# Altium schematic sheet ECU_AutoRC_BLK_r00.SchDoc
size A4; SheetNumber: 1; SheetTotal: 8
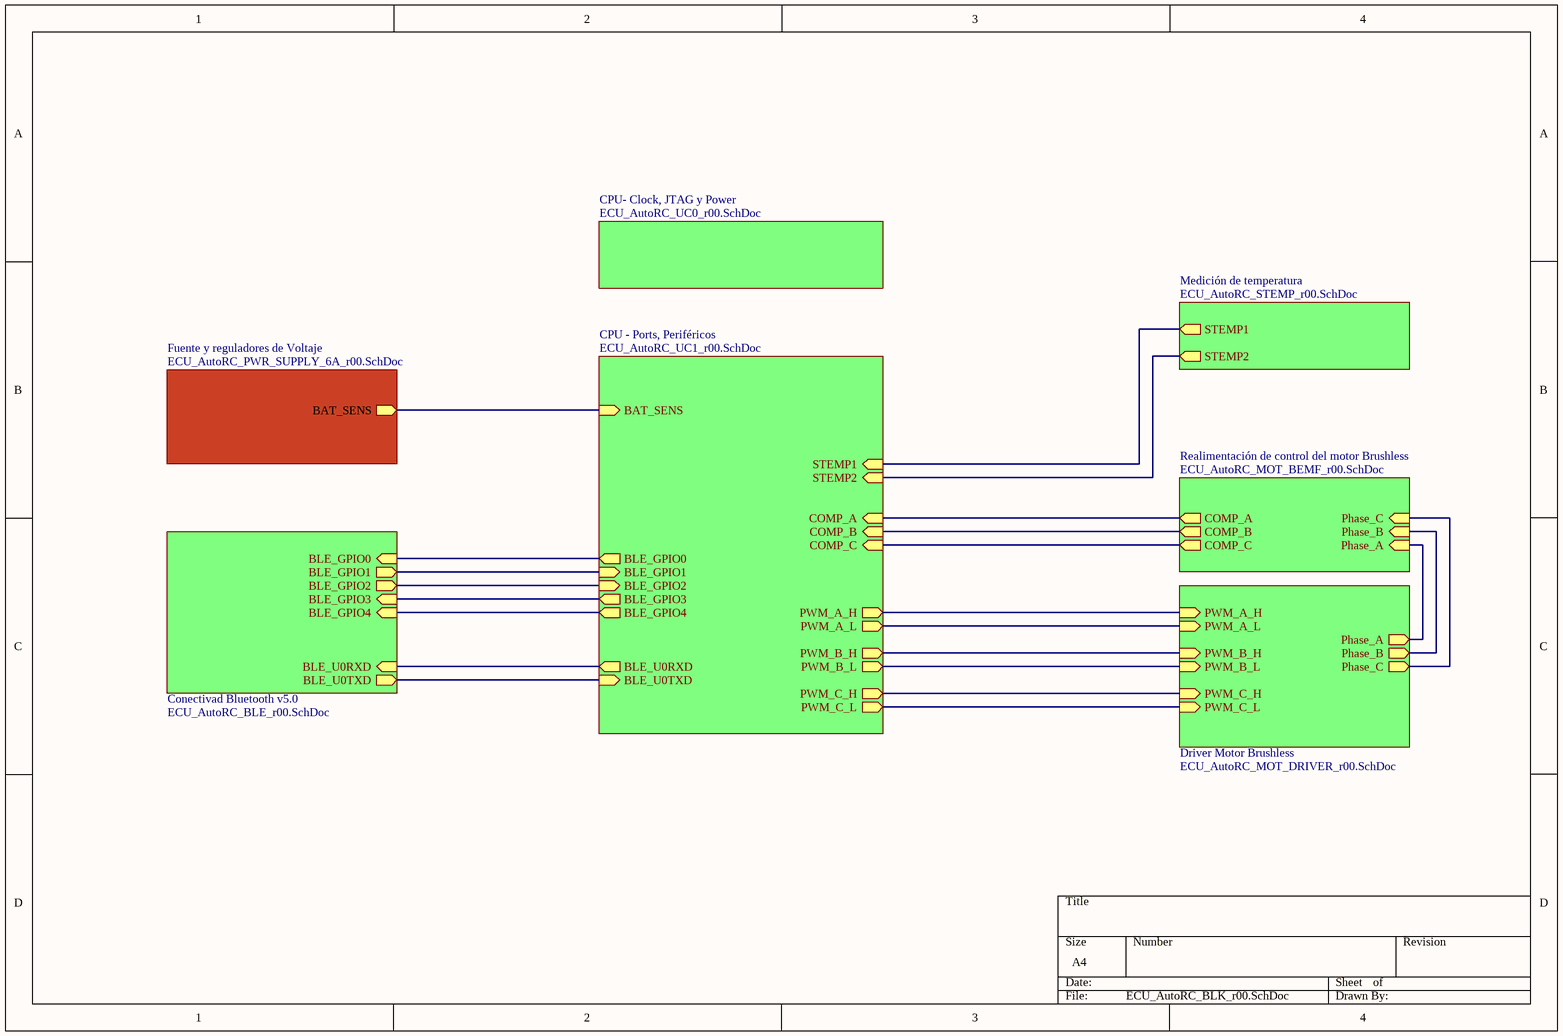
[diagram p0: ECU_AutoRC_BLK_r00.SchDoc]

## Sub-sheets
Conectivad Bluetooth v5.0 = ECU_AutoRC_BLE_r00.SchDoc: BLE_U0TXD (out), BLE_U0RXD (in), BLE_GPIO1 (out), BLE_GPIO0 (in), BLE_GPIO2 (out), BLE_GPIO3 (in), BLE_GPIO4 (in)
CPU - Ports, Periféricos = ECU_AutoRC_UC1_r00.SchDoc: STEMP1 (in), STEMP2 (in), BLE_GPIO0 (out), BLE_GPIO1 (in), BLE_U0RXD (out), BLE_U0TXD (in), COMP_A (in), COMP_B (in), COMP_C (in), PWM_A_H (out), BAT_SENS (in), PWM_A_L (out), PWM_B_H (out), PWM_B_L (out), PWM_C_H (out), PWM_C_L (out), BLE_GPIO2 (in), BLE_GPIO3 (out), BLE_GPIO4 (out)
CPU- Clock, JTAG y Power = ECU_AutoRC_UC0_r00.SchDoc: no entries
Driver Motor Brushless = ECU_AutoRC_MOT_DRIVER_r00.SchDoc: PWM_C_L (in), PWM_C_H (in), PWM_B_L (in), PWM_B_H (in), PWM_A_L (in), PWM_A_H (in), Phase_A (out), Phase_B (out), Phase_C (out)
Fuente y reguladores de Voltaje = ECU_AutoRC_PWR_SUPPLY_6A_r00.SchDoc: BAT_SENS (out)
Medición de temperatura = ECU_AutoRC_STEMP_r00.SchDoc: STEMP1 (out), STEMP2 (out)
Realimentación de control del motor Brushless = ECU_AutoRC_MOT_BEMF_r00.SchDoc: COMP_A (out), COMP_B (out), COMP_C (out), Phase_A (in), Phase_B (in), Phase_C (in)

## Nets
(unnamed): sheet Fuente y reguladores de Voltaje/BAT_SENS, sheet CPU - Ports, Periféricos/BAT_SENS
(unnamed): sheet CPU - Ports, Periféricos/STEMP1, sheet Medición de temperatura/STEMP1
(unnamed): sheet CPU - Ports, Periféricos/STEMP2, sheet Medición de temperatura/STEMP2
(unnamed): sheet CPU - Ports, Periféricos/BLE_GPIO0, sheet Conectivad Bluetooth v5.0/BLE_GPIO0
(unnamed): sheet CPU - Ports, Periféricos/BLE_GPIO1, sheet Conectivad Bluetooth v5.0/BLE_GPIO1
(unnamed): sheet CPU - Ports, Periféricos/BLE_U0RXD, sheet Conectivad Bluetooth v5.0/BLE_U0RXD
(unnamed): sheet CPU - Ports, Periféricos/BLE_U0TXD, sheet Conectivad Bluetooth v5.0/BLE_U0TXD
(unnamed): sheet CPU - Ports, Periféricos/COMP_A, sheet Realimentación de control del motor Brushless/COMP_A
(unnamed): sheet CPU - Ports, Periféricos/COMP_B, sheet Realimentación de control del motor Brushless/COMP_B
(unnamed): sheet CPU - Ports, Periféricos/COMP_C, sheet Realimentación de control del motor Brushless/COMP_C
(unnamed): sheet CPU - Ports, Periféricos/PWM_A_H, sheet Driver Motor Brushless/PWM_A_H
(unnamed): sheet CPU - Ports, Periféricos/PWM_A_L, sheet Driver Motor Brushless/PWM_A_L
(unnamed): sheet CPU - Ports, Periféricos/PWM_B_H, sheet Driver Motor Brushless/PWM_B_H
(unnamed): sheet CPU - Ports, Periféricos/PWM_B_L, sheet Driver Motor Brushless/PWM_B_L
(unnamed): sheet CPU - Ports, Periféricos/PWM_C_H, sheet Driver Motor Brushless/PWM_C_H
(unnamed): sheet CPU - Ports, Periféricos/PWM_C_L, sheet Driver Motor Brushless/PWM_C_L
(unnamed): sheet CPU - Ports, Periféricos/BLE_GPIO2, sheet Conectivad Bluetooth v5.0/BLE_GPIO2
(unnamed): sheet CPU - Ports, Periféricos/BLE_GPIO3, sheet Conectivad Bluetooth v5.0/BLE_GPIO3
(unnamed): sheet CPU - Ports, Periféricos/BLE_GPIO4, sheet Conectivad Bluetooth v5.0/BLE_GPIO4
(unnamed): sheet Driver Motor Brushless/Phase_A, sheet Realimentación de control del motor Brushless/Phase_A
(unnamed): sheet Driver Motor Brushless/Phase_B, sheet Realimentación de control del motor Brushless/Phase_B
(unnamed): sheet Driver Motor Brushless/Phase_C, sheet Realimentación de control del motor Brushless/Phase_C